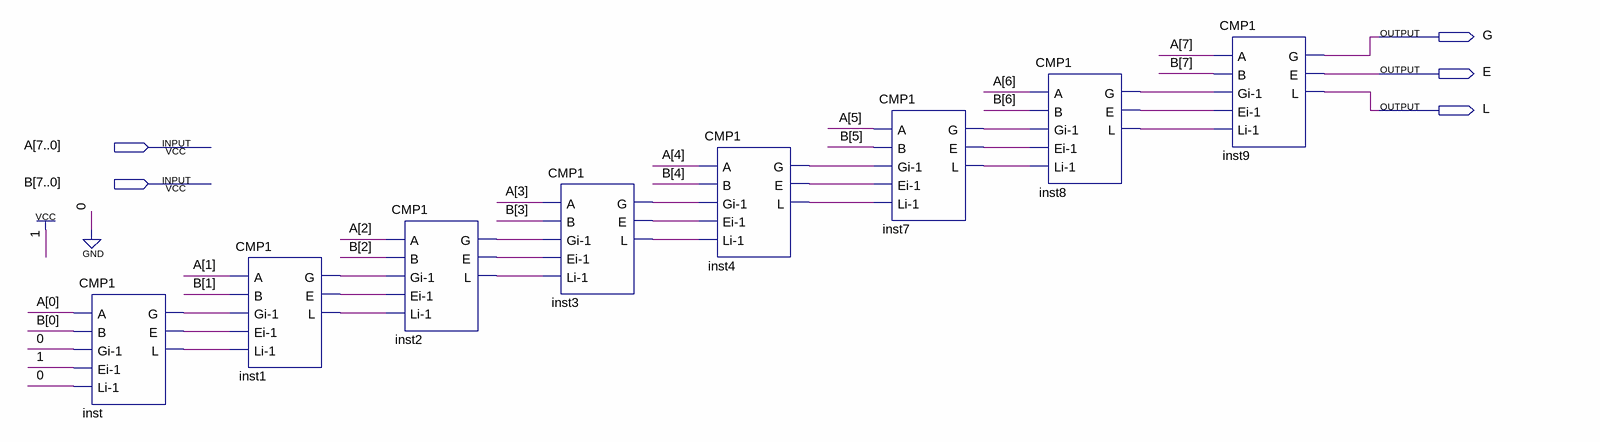
[diagram p0: schematic sheet]
// Quartus schematic CMP8.bdf as structural Verilog: 8 symbols, 5 pins
module CMP8 (
  input  [7:0] A,
  input  [7:0] B,
  output G,
  output E,
  output L
);

  wire inst1_e, inst1_g, inst1_l, inst2_e, inst2_g, inst2_l, inst3_e, inst3_g, inst3_l, inst4_e, inst4_g,
       inst4_l, inst7_e, inst7_g, inst7_l, inst8_e, inst8_g, inst8_l, inst_e, inst_g, inst_l;

  CMP1 inst (.A(A[0]), .B(B[0]), .\Gi-1 (1'b0), .\Ei-1 (1'b1), .\Li-1 (1'b0), .G(inst_g), .E(inst_e), .L(inst_l));
  CMP1 inst1 (
    .A(A[1]), .B(B[1]), .\Gi-1 (inst_g), .\Ei-1 (inst_e), .\Li-1 (inst_l), .G(inst1_g), .E(inst1_e),
    .L(inst1_l));
  CMP1 inst2 (
    .A(A[2]), .B(B[2]), .\Gi-1 (inst1_g), .\Ei-1 (inst1_e), .\Li-1 (inst1_l), .G(inst2_g), .E(inst2_e),
    .L(inst2_l));
  CMP1 inst3 (
    .A(A[3]), .B(B[3]), .\Gi-1 (inst2_g), .\Ei-1 (inst2_e), .\Li-1 (inst2_l), .G(inst3_g), .E(inst3_e),
    .L(inst3_l));
  CMP1 inst4 (
    .A(A[4]), .B(B[4]), .\Gi-1 (inst3_g), .\Ei-1 (inst3_e), .\Li-1 (inst3_l), .G(inst4_g), .E(inst4_e),
    .L(inst4_l));
  CMP1 inst7 (
    .A(A[5]), .B(B[5]), .\Gi-1 (inst4_g), .\Ei-1 (inst4_e), .\Li-1 (inst4_l), .G(inst7_g), .E(inst7_e),
    .L(inst7_l));
  CMP1 inst8 (
    .A(A[6]), .B(B[6]), .\Gi-1 (inst7_g), .\Ei-1 (inst7_e), .\Li-1 (inst7_l), .G(inst8_g), .E(inst8_e),
    .L(inst8_l));
  CMP1 inst9 (.A(A[7]), .B(B[7]), .\Gi-1 (inst8_g), .\Ei-1 (inst8_e), .\Li-1 (inst8_l), .G(G), .E(E), .L(L));
endmodule
